# Altium schematic sheet CAP_MATRIX_IN.SchDoc
size 149 x 149 mm; SheetNumber: 5; SheetTotal: 6
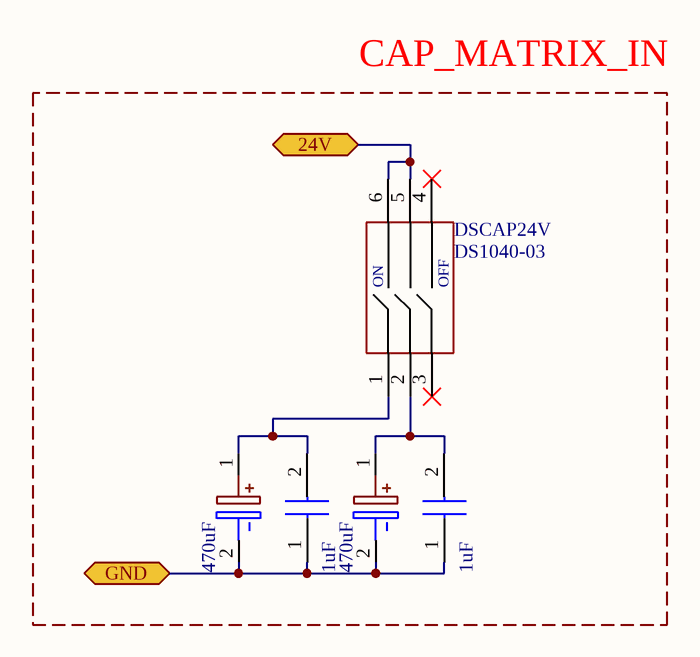
[diagram p0: CAP_MATRIX_IN.SchDoc]

## Parts
CAPCE1  1uF  [К10-17Б]
CAPCE2  1uF  [К10-17Б]
CAPEL1  470uF  [CAP-12.5x13.5]
CAPEL2  470uF  [CAP-12.5x13.5]
DSCAP24V  DS1040-03  [DS1040-03]

## Blocks framed on the sheet
CAP_MATRIX_IN: CAPCE1 CAPCE2 CAPEL1 CAPEL2 DSCAP24V

## Ports
24V (bidir), GND (bidir)

## Nets
24V: DSCAP24V.5(NO_3) DSCAP24V.6(NO_4) ; port 24V
GND: CAPCE1.1 CAPCE2.1 CAPEL1.2(-) CAPEL2.2(-) ; port GND
NetCAPCE1_2: CAPCE1.2 CAPEL1.1(+) DSCAP24V.1(COM_1)
NetCAPCE2_2: CAPCE2.2 CAPEL2.1(+) DSCAP24V.2(COM_2)

Not connected (* = marked no-connect by the designer): DSCAP24V 3(COM_3)* 4(NO_2)*

## Notes on the sheet
- (in symbol DS1040-03) ON; OFF

## Library data of the parts
CAPCE1 CAPCE2 = CAP: К10-17Б
CAPEL1 CAPEL2 = CAP-12.5x13.5: YUQINGXIN
DSCAP24V = DS1040-03: DS1040-03RN